# Altium schematic sheet Main.SchDoc: Top level scheme of Total Ionizing Dose meter (TIDm)
size A4; Date: 30.05.2015; Author: G. Gajoch, M. Gumiela; DocumentNumber: 1; SheetNumber: 1; SheetTotal: 9; Model: EM1; PageSetup: Record=PageOptions|CenterHorizontal=True|CenterVertical=True|PrintScale=0.52|XCorrection=1.00|YCorrection=1.00|PrintKind=1|BorderSize=5000000|LeftOffset=0|BottomOffset=0|Orientation=2|PaperLength=4200|PaperWidth=2970|Scale=100|PaperSource=7|PrintQuality=600|MediaType=1|DitherType=10|PaperKind=A3|PrintScaleMode=1
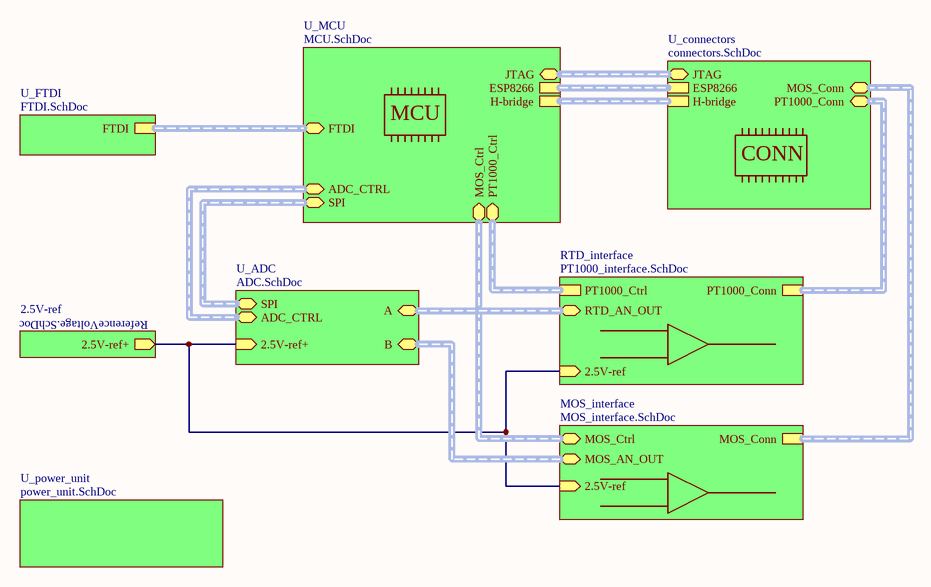
[diagram p0: Main.SchDoc]

## Sub-sheets
2.5V-ref = ReferenceVoltage.SchDoc: 2.5V-ref+ (out)
MOS_interface = MOS_interface.SchDoc: MOS_Conn (harness MUX_Conn), MOS_AN_OUT (harness ADC_IN), 2.5V-ref (in), MOS_Ctrl (harness MUX_Ctrl)
RTD_interface = PT1000_interface.SchDoc: PT1000_Ctrl (harness MUX_Ctrl), PT1000_Conn (harness MUX_Conn), 2.5V-ref (in), RTD_AN_OUT (harness ADC_IN)
U_ADC = ADC.SchDoc: A (harness ADC_IN), B (harness ADC_IN), ADC_CTRL (harness ADC_CTRL), 2.5V-ref+ (in), SPI (harness SPI)
U_connectors = connectors.SchDoc: ESP8266 (harness ESP8266), H-bridge (harness H-Bridge), PT1000_Conn (harness MUX_Conn), MOS_Conn (harness MUX_Conn), JTAG (harness JTAG)
U_FTDI = FTDI.SchDoc: FTDI (harness FTDI)
U_MCU = MCU.SchDoc: ESP8266 (harness ESP8266), H-bridge (harness H-Bridge), JTAG (harness JTAG), FTDI (harness FTDI), ADC_CTRL (harness ADC_CTRL), SPI (harness SPI), PT1000_Ctrl (harness MUX_Ctrl), MOS_Ctrl
U_power_unit = power_unit.SchDoc: no entries

## Nets
(unnamed): sheet MOS_interface/2.5V-ref, sheet RTD_interface/2.5V-ref, sheet U_ADC/2.5V-ref+, sheet 2.5V-ref/2.5V-ref+

## Buses and harness runs
harness sheet MOS_interface/MOS_AN_OUT = sheet U_ADC/B
harness sheet MOS_interface/MOS_Conn = sheet U_connectors/MOS_Conn
harness sheet MOS_interface/MOS_Ctrl = sheet U_MCU/MOS_Ctrl
harness sheet RTD_interface/PT1000_Conn = sheet U_connectors/PT1000_Conn
harness sheet RTD_interface/PT1000_Ctrl = sheet U_MCU/PT1000_Ctrl
harness sheet RTD_interface/RTD_AN_OUT = sheet U_ADC/A
harness sheet U_ADC/ADC_CTRL = sheet U_MCU/ADC_CTRL
harness sheet U_ADC/SPI = sheet U_MCU/SPI
harness sheet U_connectors/ESP8266 = sheet U_MCU/ESP8266
harness sheet U_connectors/H-bridge = sheet U_MCU/H-bridge
harness sheet U_connectors/JTAG = sheet U_MCU/JTAG
harness sheet U_FTDI/FTDI = sheet U_MCU/FTDI

## Notes on the sheet
- MCU
- CONN
- Title:
- Sheet:
- of
- Author:
- Model:
- Document Number:
- Checked by:
- Iss-Rev:
- Approved by:
- Date:
- File name: